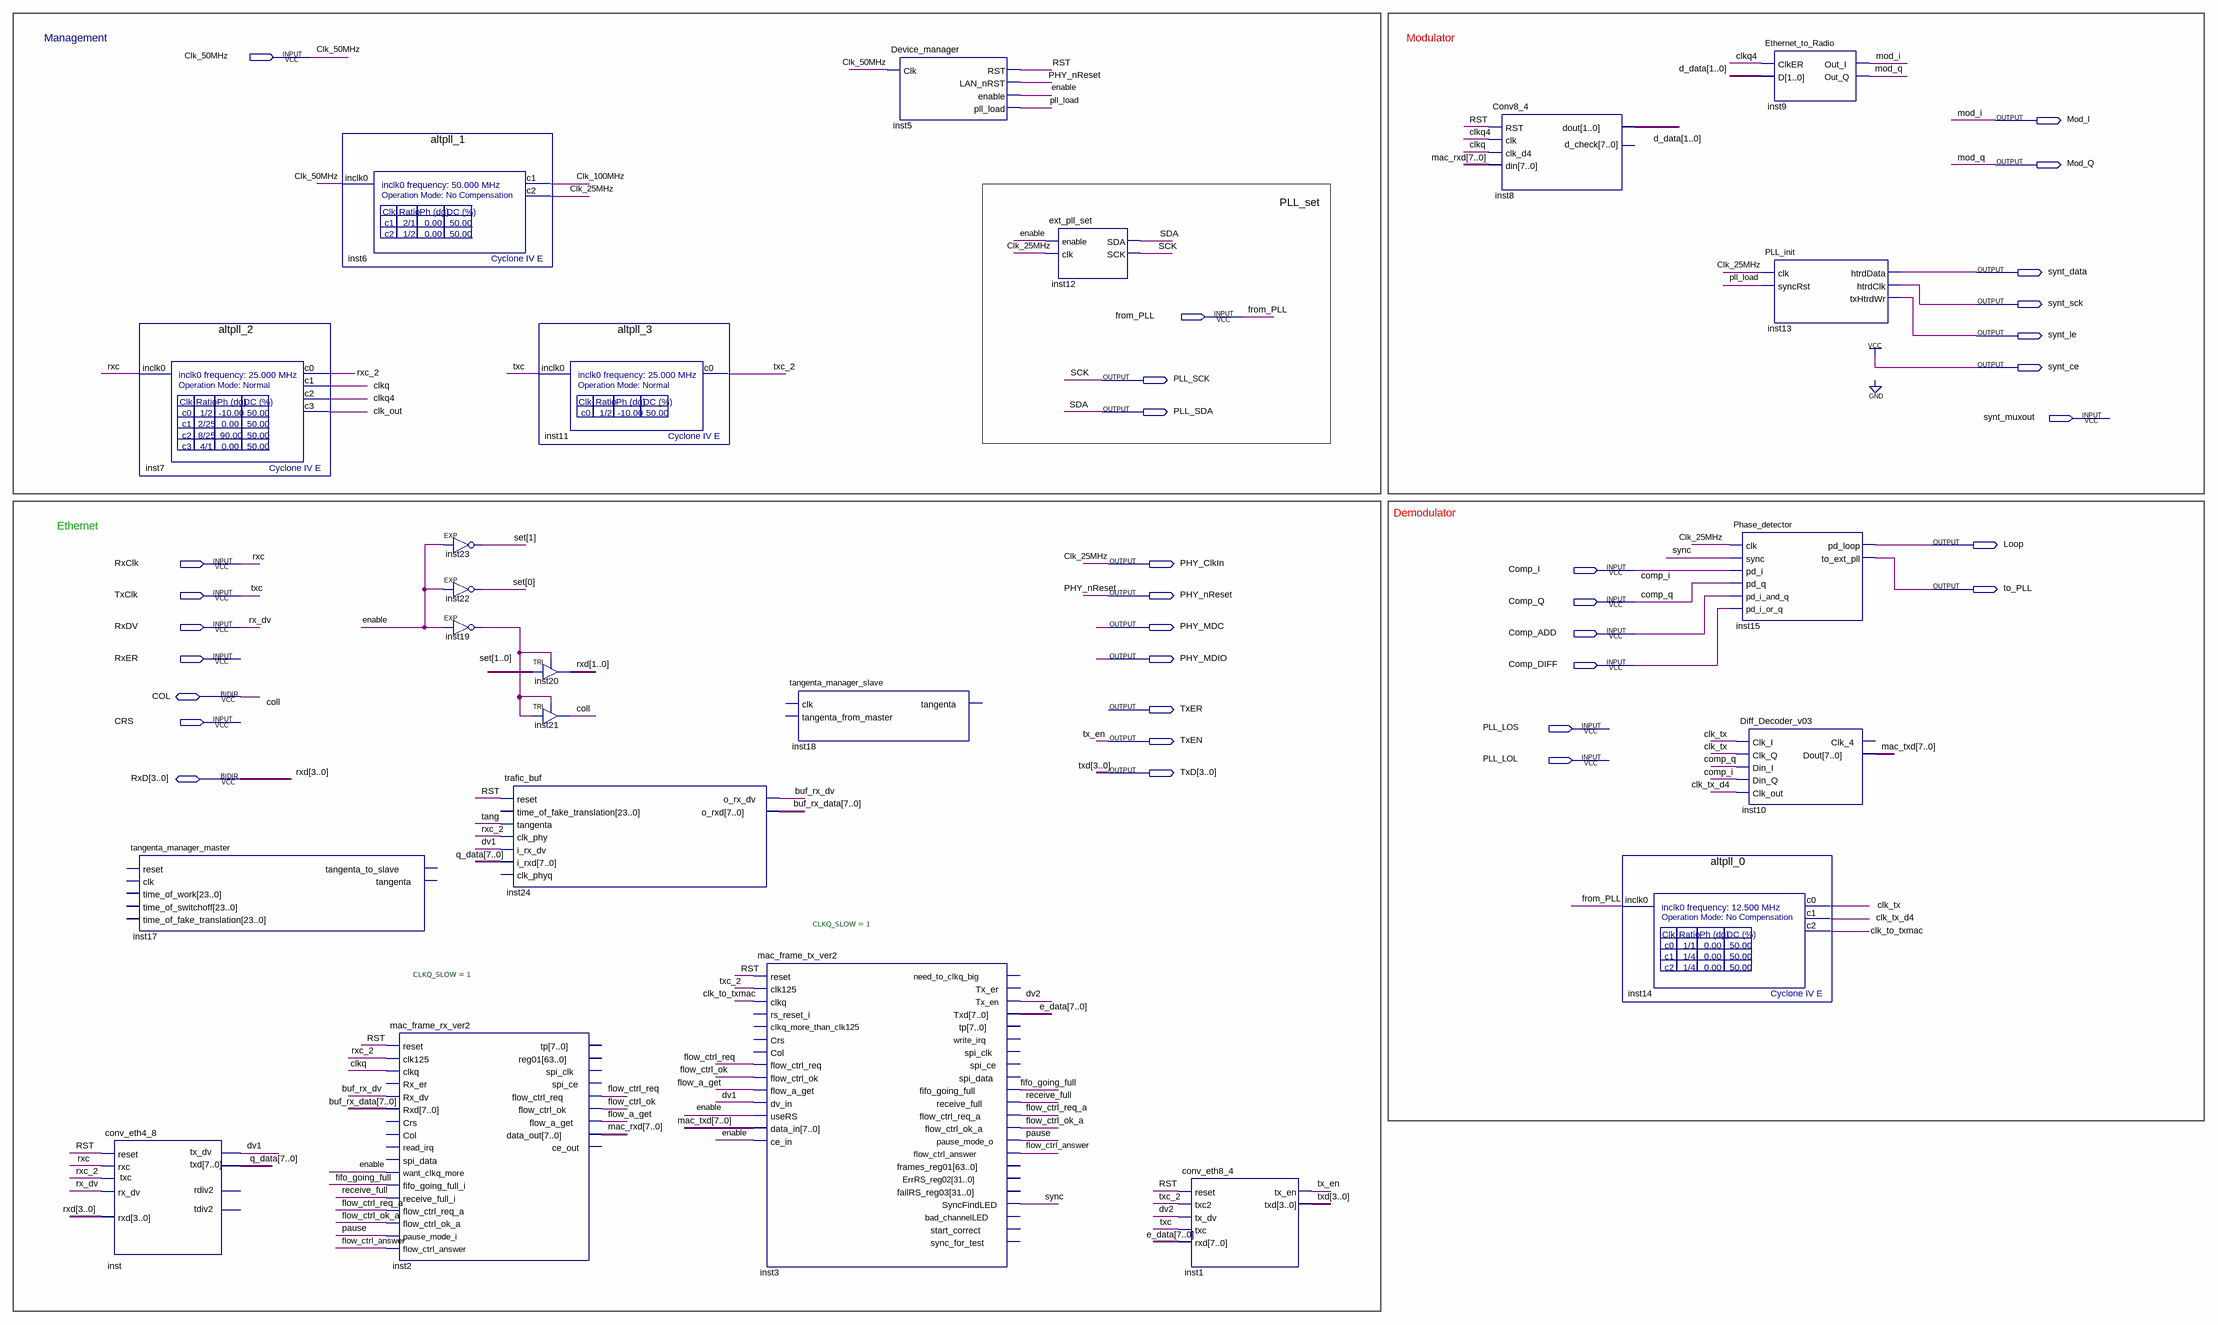
[diagram p0: schematic sheet]
// Quartus schematic Modem_Elanus.bdf as structural Verilog: 23 symbols, 33 pins
module Modem_Elanus (
  input  Clk_50MHz,
  input  from_PLL,
  input  synt_muxout,
  input  RxClk,
  input  Comp_I,
  input  TxClk,
  input  Comp_Q,
  input  RxDV,
  input  Comp_ADD,
  input  RxER,
  input  Comp_DIFF,
  input  CRS,
  input  PLL_LOS,
  input  PLL_LOL,
  inout  COL,
  inout  [3:0] RxD,
  output Mod_I,
  output Mod_Q,
  output synt_data,
  output synt_sck,
  output synt_le,
  output synt_ce,
  output PLL_SCK,
  output PLL_SDA,
  output Loop,
  output PHY_ClkIn,
  output to_PLL,
  output PHY_nReset,
  output PHY_MDC,
  output PHY_MDIO,
  output TxER,
  output TxEN,
  output [3:0] TxD
);

  wire buf_rx_dv, Clk_100MHz, clk_out, clk_to_txmac, clk_tx, clk_tx_d4, clkq, clkq4, dv1, dv2, enable,
       fifo_going_full, flow_a_get, flow_ctrl_answer, flow_ctrl_ok, flow_ctrl_ok_a, flow_ctrl_req,
       flow_ctrl_req_a, inst19_out, pause, pll_load, receive_full, RST, rxc_2, sync, tang, txc_2;
  wire [1:0] d_data, set;
  wire [7:0] buf_rx_data, e_data, mac_rxd, mac_txd, q_data;

  tangenta_manager_master inst17 ();  // open: reset, clk, time_of_work, time_of_switchoff, time_of_fake_translation, tangenta_to_slave, tangenta
  conv_eth4_8 inst (
    .reset(RST), .rxc(RxClk), .rx_dv(RxDV), .rxd(RxD), .txc(rxc_2), .tx_dv(dv1), .txd(q_data));  // open: rdiv2, tdiv2
  altpll_2 inst7 (.inclk0(RxClk), .c0(rxc_2), .c1(clkq), .c2(clkq4), .c3(clk_out));
  altpll_1 inst6 (.inclk0(Clk_50MHz), .c1(Clk_100MHz), .c2(PHY_ClkIn));
  mac_frame_rx_ver2 #(.CLKQ_SLOW(1)) inst2 (
    .reset(RST), .clk125(rxc_2), .clkq(clkq), .Rx_dv(buf_rx_dv), .Rxd(buf_rx_data), .want_clkq_more(enable),
    .fifo_going_full_i(fifo_going_full), .receive_full_i(receive_full), .flow_ctrl_req_a(flow_ctrl_req_a),
    .flow_ctrl_ok_a(flow_ctrl_ok_a), .pause_mode_i(pause), .flow_ctrl_answer(flow_ctrl_answer),
    .flow_ctrl_req(flow_ctrl_req), .flow_ctrl_ok(flow_ctrl_ok), .flow_a_get(flow_a_get), .data_out(mac_rxd));  // open: Rx_er, Crs, Col, read_irq, spi_data, tp, reg01, spi_clk, spi_ce, ce_out
  EXP inst23 (.IN(enable), .OUT(set[1]));
  EXP inst22 (.IN(enable), .OUT(set[0]));
  EXP inst19 (.IN(enable), .OUT(inst19_out));
  TRI inst20[1:0] (.IN(set), .OE(inst19_out), .OUT(RxD[1:0]));
  TRI inst21 (.IN(inst19_out), .OE(inst19_out), .OUT(COL));
  trafic_buf inst24 (
    .reset(RST), .tangenta(tang), .clk_phy(rxc_2), .i_rx_dv(dv1), .i_rxd(q_data), .o_rx_dv(buf_rx_dv),
    .o_rxd(buf_rx_data));  // open: time_of_fake_translation, clk_phyq
  altpll_3 inst11 (.inclk0(TxClk), .c0(txc_2));
  tangenta_manager_slave inst18 ();  // open: clk, tangenta_from_master, tangenta
  mac_frame_tx_ver2 #(.CLKQ_SLOW(1)) inst3 (
    .reset(RST), .clk125(txc_2), .clkq(clk_to_txmac), .flow_ctrl_req(flow_ctrl_req),
    .flow_ctrl_ok(flow_ctrl_ok), .flow_a_get(flow_a_get), .dv_in(dv1), .useRS(enable), .data_in(mac_txd),
    .ce_in(enable), .Tx_en(dv2), .Txd(e_data), .fifo_going_full(fifo_going_full),
    .receive_full(receive_full), .flow_ctrl_req_a(flow_ctrl_req_a), .flow_ctrl_ok_a(flow_ctrl_ok_a),
    .pause_mode_o(pause), .flow_ctrl_answer(flow_ctrl_answer), .SyncFindLED(sync));  // open: rs_reset_i, clkq_more_than_clk125, Crs, Col, need_to_clkq_big, Tx_er, tp, write_irq, spi_clk, spi_ce, spi_data, frames_reg01, ErrRS_reg02, failRS_reg03, bad_channelLED, start_correct, sync_for_test
  Device_manager inst5 (.Clk(Clk_50MHz), .RST(RST), .LAN_nRST(PHY_nReset), .enable(enable), .pll_load(pll_load));
  ext_pll_set inst12 (.enable(enable), .clk(PHY_ClkIn), .SDA(PLL_SDA), .SCK(PLL_SCK));
  conv_eth8_4 inst1 (.reset(RST), .txc2(txc_2), .tx_dv(dv2), .txc(TxClk), .rxd(e_data), .tx_en(TxEN), .txd(TxD));
  Conv8_4 inst8 (.RST(RST), .clk(clkq4), .din(mac_rxd), .clk_d4(clkq), .dout(d_data));  // open: d_check
  altpll_0 inst14 (.inclk0(from_PLL), .c0(clk_tx), .c1(clk_tx_d4), .c2(clk_to_txmac));
  Phase_detector inst15 (
    .clk(PHY_ClkIn), .sync(sync), .pd_i(Comp_I), .pd_q(Comp_Q), .pd_i_and_q(Comp_ADD), .pd_i_or_q(Comp_DIFF),
    .pd_loop(Loop), .to_ext_pll(to_PLL));
  Diff_Decoder_v03 inst10 (
    .Clk_I(clk_tx), .Clk_Q(clk_tx), .Din_I(Comp_Q), .Din_Q(Comp_I), .Clk_out(clk_tx_d4), .Dout(mac_txd));  // open: Clk_4
  Ethernet_to_Radio inst9 (.ClkER(clkq4), .D(d_data), .Out_I(Mod_I), .Out_Q(Mod_Q));
  PLL_init inst13 (.clk(PHY_ClkIn), .syncRst(pll_load), .htrdData(synt_data), .htrdClk(synt_sck), .txHtrdWr(synt_le));

  assign synt_ce = 1'b1;

  // Other names for the same wires on the sheet: Clk_25MHz = PHY_ClkIn; coll = COL; rx_dv = RxDV; rxc = RxClk;
  //   SCK = PLL_SCK; SDA = PLL_SDA; tx_en = TxEN; txc = TxClk

  // Notes on the sheet:
  //   Management
  //   Modulator
  //   PLL_set
  //   Demodulator
  //   Ethernet
endmodule
